# EAGLE design bottom (EAGLE 7.2.0)
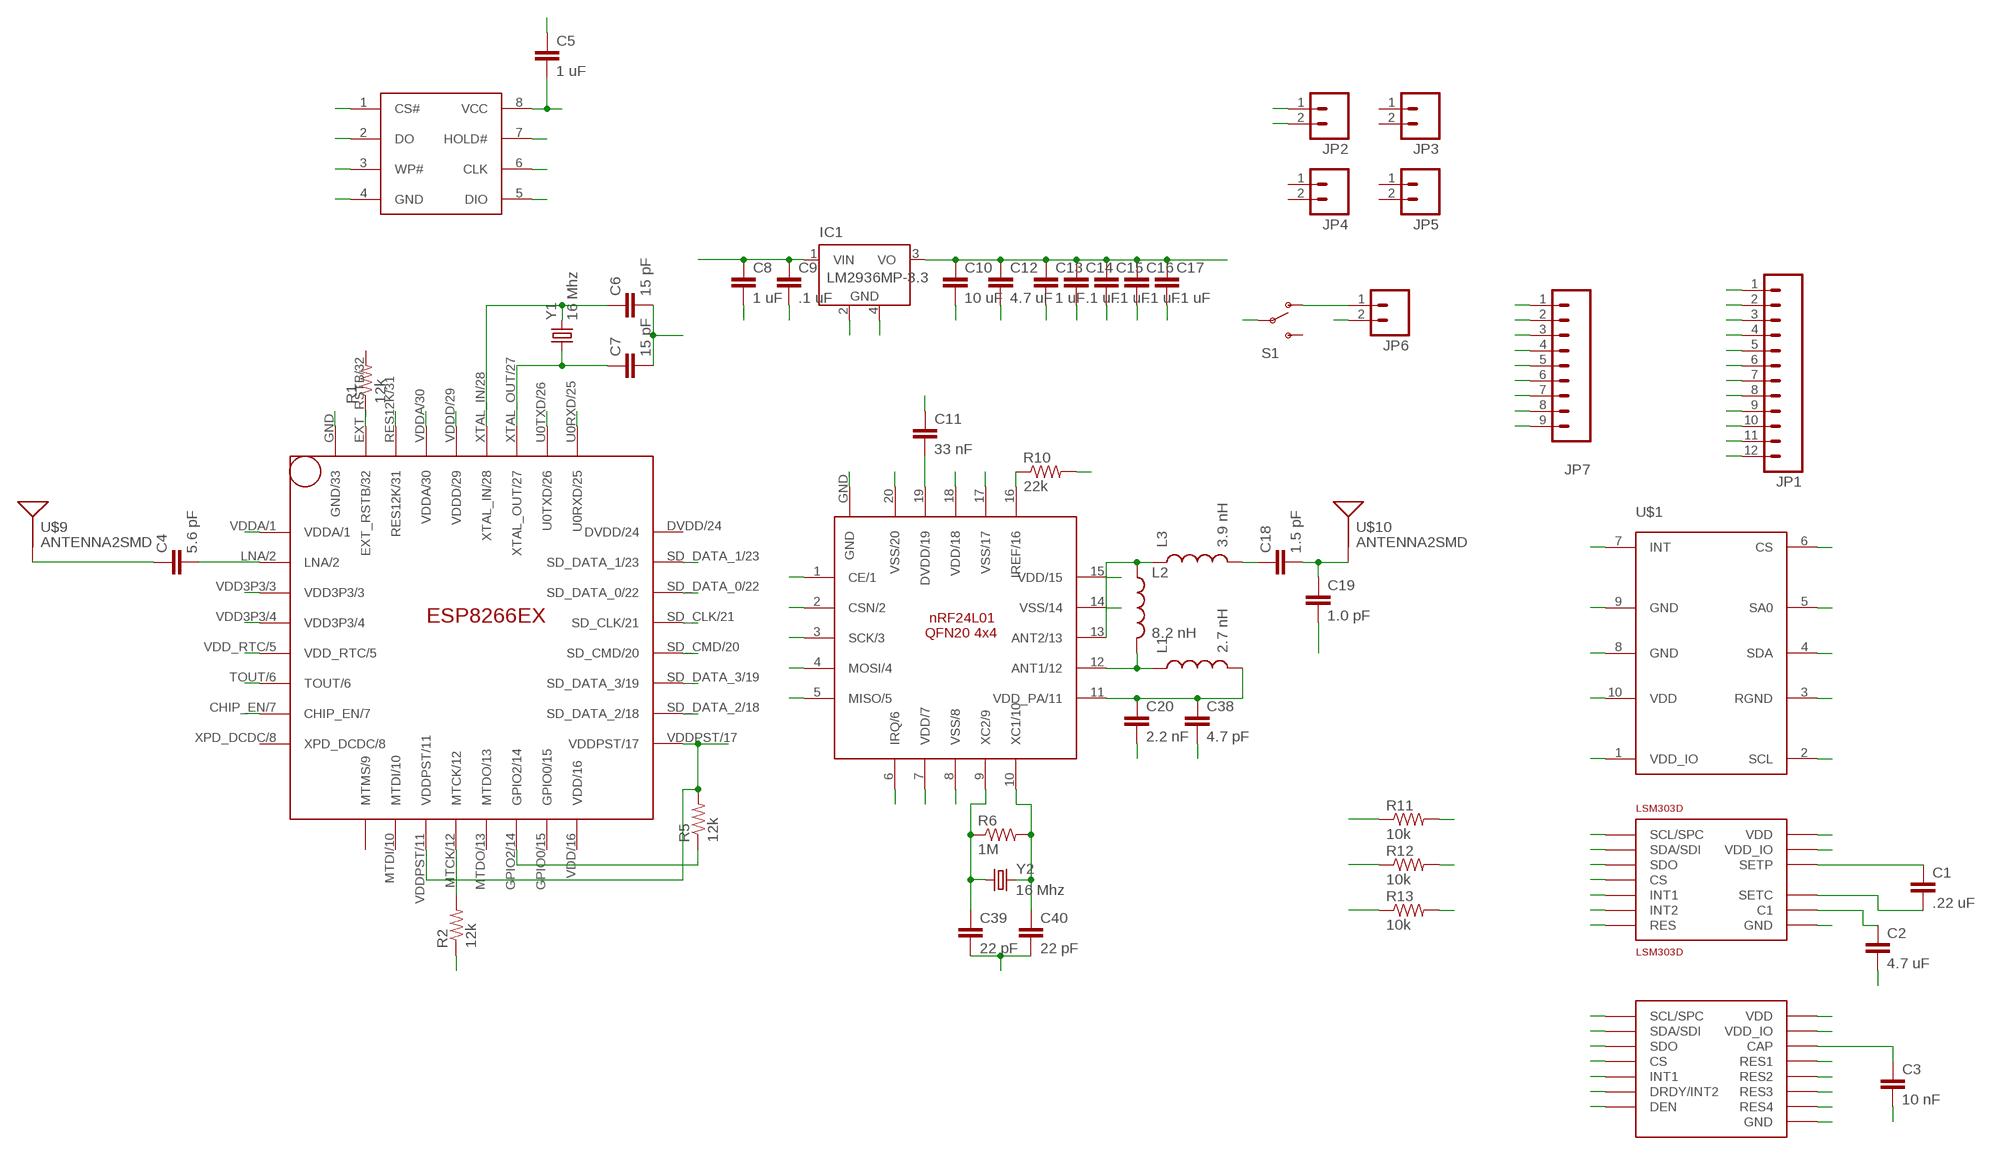
[diagram p0: schematic, sheet 1]

## Parts
C1  .22 uF  CAP0603-CAP  [0603-CAP]
C2  4.7 uF  CAP0603-CAP  [0603-CAP]
C3  10 nF  CAP0603-CAP  [0603-CAP]
C4  5.6 pF  CAP0603-CAP  [0603-CAP]
C5  1 uF  CAP0603-CAP  [0603-CAP]
C6  15 pF  CAP0603-CAP  [0603-CAP]
C7  15 pF  CAP0603-CAP  [0603-CAP]
C8  1 uF  CAP0603-CAP  [0603-CAP]
C9  .1 uF  CAP0603-CAP  [0603-CAP]
C10  10 uF  CAP0603-CAP  [0603-CAP]
C11  33 nF  CAP0603-CAP  [0603-CAP]
C12  4.7 uF  CAP0603-CAP  [0603-CAP]
C13  1 uF  CAP0603-CAP  [0603-CAP]
C14  .1 uF  CAP0603-CAP  [0603-CAP]
C15  .1 uF  CAP0603-CAP  [0603-CAP]
C16  .1 uF  CAP0603-CAP  [0603-CAP]
C17  .1 uF  CAP0603-CAP  [0603-CAP]
C18  1.5 pF  CAP0603-CAP  [0603-CAP]
C19  1.0 pF  CAP0603-CAP  [0603-CAP]
C20  2.2 nF  CAP0603-CAP  [0603-CAP]
C38  4.7 pF  CAP0603-CAP  [0603-CAP]
C39  22 pF  CAP0603-CAP  [0603-CAP]
C40  22 pF  CAP0603-CAP  [0603-CAP]
IC1  LM2936MP-3.3  [SOT223]
JP1  M12PTH  [1X12]
JP2  M02LOCK  [1X02_LOCK]
JP3  M02LOCK  [1X02_LOCK]
JP4  M02LOCK  [1X02_LOCK]
JP5  M02LOCK  [1X02_LOCK]
JP6  M02LOCK  [1X02_LOCK]
JP7  M09  [1X09]
L1  2.7 nH  INDUCTOR0402  [C0402]
L2  8.2 nH  INDUCTOR0402  [C0402]
L3  3.9 nH  INDUCTOR0402  [C0402]
LSM303D  LSM303D  [LGA16L]
MESH  NRF24L01  [QFN20(4X4)]
R1  12k  RESISTOR0603-RES  [0603-RES]
R2  12k  RESISTOR0603-RES  [0603-RES]
R5  12k  RESISTOR0603-RES  [0603-RES]
R6  1M  RESISTOR0603-RES  [0603-RES]
R10  22k  RESISTOR0603-RES  [0603-RES]
R11  10k  RESISTOR0603-RES  [0603-RES]
R12  10k  RESISTOR0603-RES  [0603-RES]
R13  10k  RESISTOR0603-RES  [0603-RES]
S1  SWITCH-SPDT-SMD-A  [SWITCH-SPST-SMD-A]
U$1  LPS25H  [LPS25H]
U$2  L3GD20H  [LGA16L]
U$3  25Q40  [SOP8]
U$9  ANTENNA2SMD  [ANTENNA-CHIP2]
U$10  ANTENNA2SMD  [ANTENNA-CHIP2]
WIFI  ESP8266EX  [QFN32]
Y1  16 Mhz  CRYSTAL5X3  [CRYSTAL-SMD-5X3]
Y2  16 Mhz  CRYSTAL5X3  [CRYSTAL-SMD-5X3]

## Nets
CE: JP7.3 MESH.1(CE/1)
CSN: JP7.4 MESH.2(CSN/2)
GND: C2.2 C5.1 C6.2 C7.2 C8.2 C9.2 C10.2 C11.1 C12.2 C13.2 C14.2 C15.2 C16.2 C17.2 C19.2 C20.2 C38.2 C39.2 C40.2 IC1.2(GND) IC1.4(GND) JP1.1 JP1.2 JP1.3 JP1.4 JP1.5 JP1.6 JP2.2 JP6.2 LSM303D.P$5(GND) LSM303D.P$10(RES) LSM303D.P$12(GND) LSM303D.P$13(GND) LSM303D.P$16(GND) MESH.8(VSS/8) MESH.14(VSS/14) MESH.17(VSS/17) MESH.20(VSS/20) R2.1 R10.2 U$1.3(RGND) U$1.8(GND) U$1.9(GND) U$2.P$8(DEN) U$2.P$9(RES1) U$2.P$10(RES2) U$2.P$11(RES3) U$2.P$12(GND) U$2.P$13(GND) U$3.4(GND) WIFI.GND(GND/33)
IQR: MESH.6(IRQ/6)
MISO: JP7.6 MESH.5(MISO/5)
MOSI: JP7.5 MESH.4(MOSI/4)
N$1: C4.1 U$9.FEED(SIGNAL)
N$2: R5.1 WIFI.GPIO2/14
N$3: R2.2 WIFI.MTCK/12
N$5: L1.1 L2.2 MESH.12(ANT1/12)
N$6: C18.1 L3.2
N$10: C18.2 C19.1 U$10.FEED(SIGNAL)
N$11: U$2.P$7(INT1)
N$12: U$2.P$6(DRDY/INT2)
N$13: C4.2 WIFI.LNA/2
N$14: U$1.7(INT)
N$16: C39.1 MESH.9(XC2/9) R6.1 Y2.1
N$17: C40.1 MESH.10(XC1/10) R6.2 Y2.3
N$18: C20.1 C38.1 L1.2 MESH.11(VDD_PA/11)
N$19: L2.1 L3.1 MESH.13(ANT2/13)
N$22: C3.1 U$2.P$14(CAP)
N$24: MESH.16(IREF/16) R10.1
N$28: C11.2 MESH.19(DVDD/19)
N$30: MESH.GND
N$31: C3.2
N$35: LSM303D.P$11(INT1)
N$36: LSM303D.P$9(INT2)
N$38: WIFI.RES12K/31
N$42: C1.2 LSM303D.P$2(SETC)
N$43: C2.1 LSM303D.P$15(C1)
RST: R1.1 WIFI.EXT_RSTB/32
RTC: WIFI.VDD_RTC/5
RX_W: JP7.1 WIFI.U0TXD/26
SCK: JP7.7 MESH.3(SCK/3)
SCL: JP7.9 LSM303D.P$4(SCL/SPC) R12.2 U$1.2(SCL) U$2.P$2(SCL/SPC)
SD-CLK: U$3.6(CLK) WIFI.SD_CLK/21
SD-CMD: U$3.1(CS#) WIFI.SD_CMD/20
SD-D0: U$3.2(DO) WIFI.SD_DATA_0/22
SD-D1: U$3.5(DIO) WIFI.SD_DATA_1/23
SD-D2: U$3.7(HOLD#) WIFI.SD_DATA_2/18
SD-D3: U$3.3(WP#) WIFI.SD_DATA_3/19
SDA: JP7.8 LSM303D.P$6(SDA/SDI) R11.2 U$1.4(SDA) U$2.P$3(SDA/SDI)
SDO: LSM303D.P$7(SDO) R13.2 U$1.5(SA0) U$2.P$4(SDO)
SETP: C1.1 LSM303D.P$3(SETP)
TOUT: WIFI.TOUT/6
TX_W: JP7.2 WIFI.U0RXD/25
VDD: C5.2 C10.1 C12.1 C13.1 C14.1 C15.1 C16.1 C17.1 IC1.3(VO) JP1.7 JP1.8 JP1.9 JP1.10 JP1.11 JP1.12 JP2.1 LSM303D.P$1(VDD_IO) LSM303D.P$8(CS) LSM303D.P$14(VDD) MESH.7(VDD/7) MESH.15(VDD/15) MESH.18(VDD/18) R5.2 R11.1 R12.1 R13.1 U$1.1(VDD_IO) U$1.6(CS) U$1.10(VDD) U$2.P$1(VDD_IO) U$2.P$5(CS) U$2.P$15(RES4) U$2.P$16(VDD) U$3.8(VCC) WIFI.CHIP_EN/7 WIFI.VDD3P3/3 WIFI.VDD3P3/4 WIFI.VDDA/1 WIFI.VDDA/30 WIFI.VDDD/29 WIFI.VDDPST/11 WIFI.VDDPST/17
VIN: JP6.1 S1.1(O)
VRAW: C8.1 C9.1 IC1.1(VIN) S1.2(P)
XTAL_IN: C6.1 WIFI.XTAL_IN/28 Y1.3
XTAL_OUT: C7.1 WIFI.XTAL_OUT/27 Y1.1
Unconnected: JP3.1 JP3.2 JP4.1 JP4.2 JP5.1 JP5.2 R1.2 S1.3(S) WIFI.DVDD/24 WIFI.GPIO0/15 WIFI.MTDI/10 WIFI.MTDO/13 WIFI.MTMS/9 WIFI.VDD/16 WIFI.XPD_DCDC/8

## Library data of the parts
C1-C20 C38-C40 = SparkFun-Capacitors:CAP: Capacitor Standard 0603 ceramic capacitor, and 0.1" leaded capacitor.
IC1 = national-semiconductor:LM2936MP?*: Ultra-Low Quiescent Current LDO Voltage Regulator Source: Data sheet <http://www.national.com/ds/LM/LM2936.pdf>; MF: NATIONAL SEMICONDUCTOR; MPN: LM2936MP-3.3/NOPB; OC_FARNELL: 1469062; OC_NEWARK: 41K4523
JP1 = SparkFun-Connectors:M12: Header 12 Standard 12-pin 0.1" header. Use with straight break away headers (SKU : PRT-00116), right angle break away headers (PRT-00553), swiss pins (PRT-00743), machine pins (PRT-00117), and female headers (PRT-00115).
JP2-JP6 = SparkFun-Connectors:M02: Standard 2-pin 0.1" header. Use with - straight break away headers ( PRT-00116) - right angle break away headers (PRT-00553) - swiss pins (PRT-00743) - machine pins (PRT-00117) - female headers (PRT-00115) Molex polarized connector foot print use with: PRT-08233 with associated crimp pins and housings. 2.54_SCREWTERM for use with PRT-10571. 3.5mm Screw Terminal footprints for PRT-08084 5mm Screw Terminal footprints for use with PRT-08432
JP7 = SparkFun-Connectors:M09: Header 9 Standard 9-pin 0.1" header. Use with straight break away headers (SKU : PRT-00116), right angle break away headers (PRT-00553), swiss pins (PRT-00743), machine pins (PRT-00117), and female headers (PRT-00115).
L1-L3 = SparkFun-Passives:INDUCTOR: Inductors Basic Inductor/Choke - 0603 and 1206. Footprints are not proven and vary greatly between part numbers. INDUCTOR POWER 3.3UH 4.0A SMD 0.197" L x 0.197" W x 0.177" H (5.00mm x 5.00mm x 4.50mm)
LSM303D = st:LSM303D
MESH = RF:NRF24L01
R1 R2 R5 R6 R10-R13 = SparkFun-Resistors:RESISTOR: Resistor Basic schematic elements and footprints for 0603, 1206, and PTH resistors.
S1 = SparkFun-Electromechanical:SWITCH-SPDT: SPDT Switch Simple slide switch, Spark Fun Electronics SKU : COM-00102 DPDT SMT slide switch, AYZ0202, SWCH-08179
U$1 = chips:LPS25H: ST-Micro Piezoresistive pressure sensor; DIGIKEY: 497-15070-1-ND
U$2 = st:L3GD20H
U$3 = wifi:25Q40
U$9 U$10 = SparkFun-RF:ANTENNA2: Chip antenna Single endded antenna. Common with smaller chip antennas. CHIP4 package is the GPS Chip Antenna SKU: GPS-08418. CHIP5 package is 2.4GHz chip antenna SKU: WRL-00144.
WIFI = wifi:ESP8266EX
Y1 Y2 = SparkFun-FreqCtrl:CRYSTAL: Various standard crystals. Proven footprints.; PROD_ID: XTAL-08218

## Board
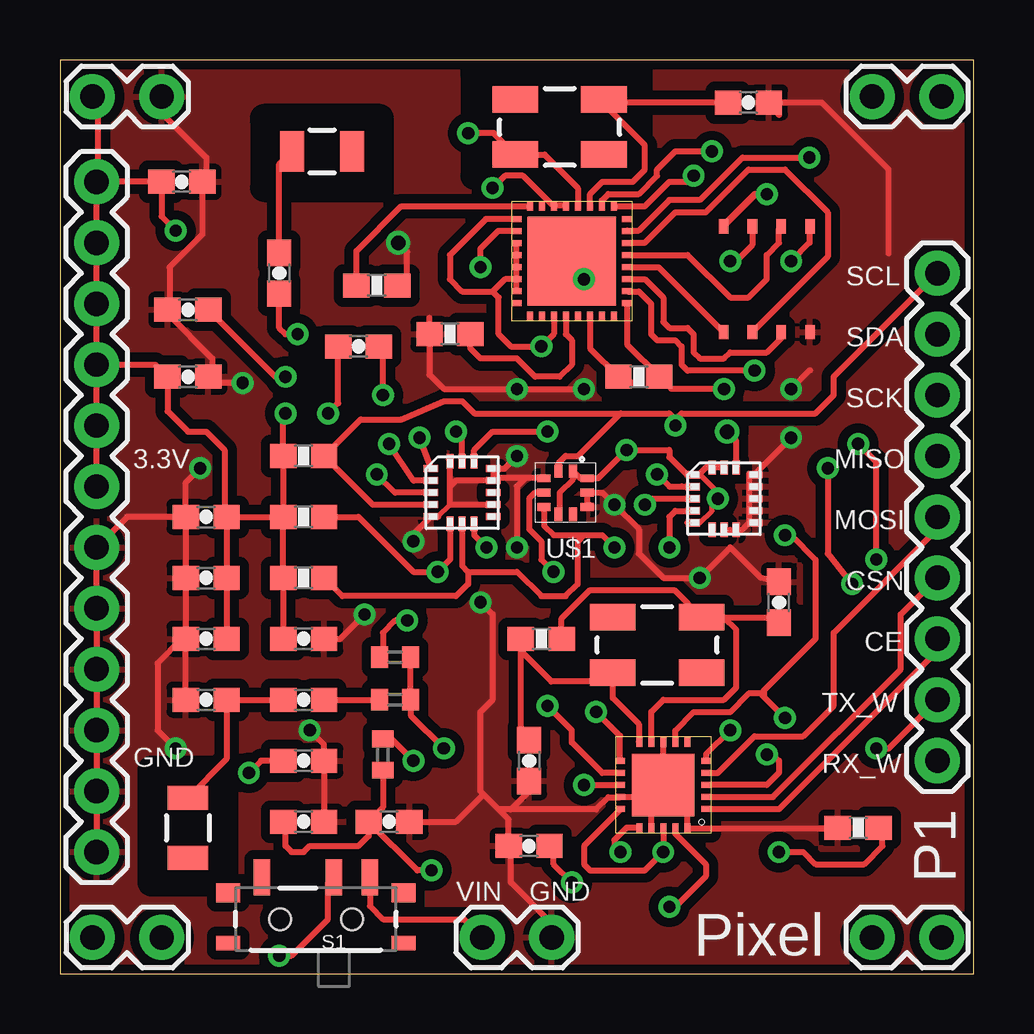
[diagram p1: board, top side]
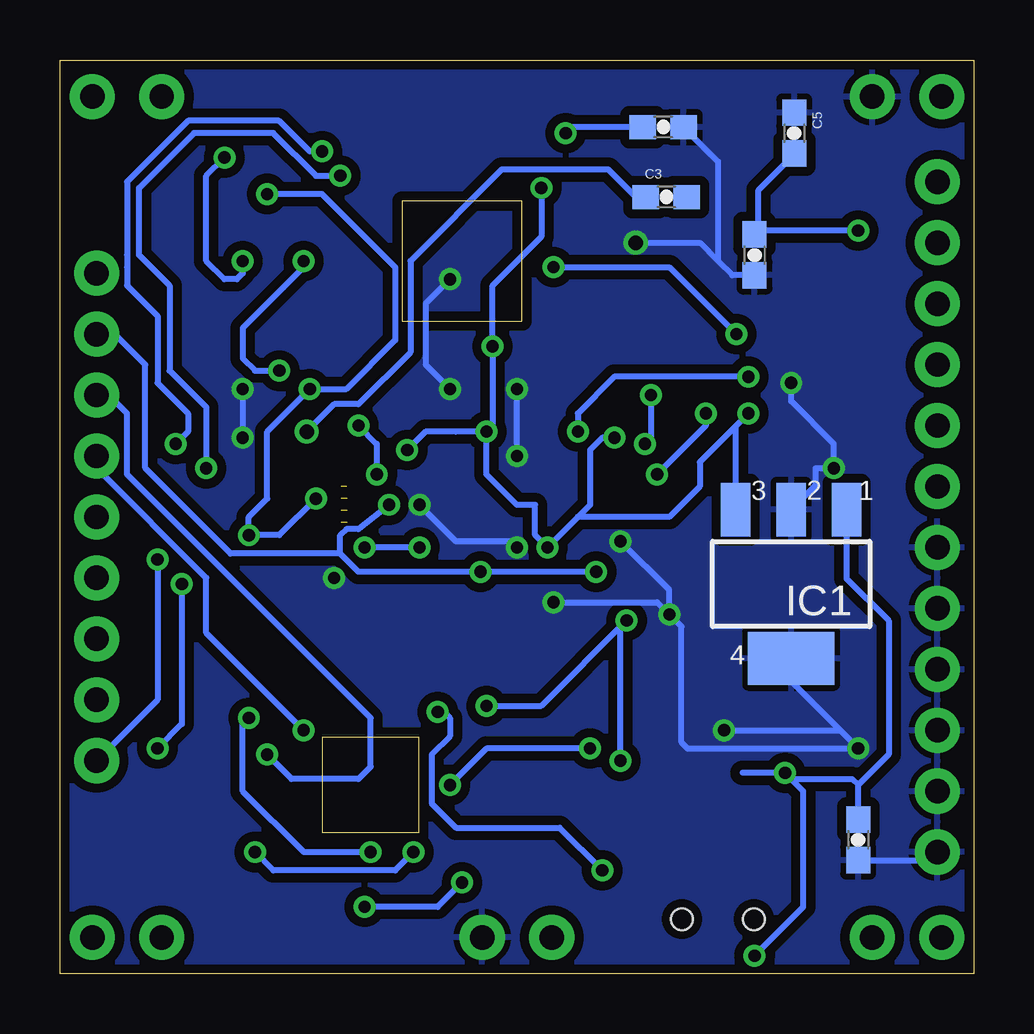
[diagram p2: board, bottom side, seen from below]

Size 38.1 x 38.1 mm. Coordinates in mm from the lower left corner, seen from the top.
Outline: 0,0 38.1,0 38.1,38.1 0,38.1 0,0
Copper layers (1*16): Top 0.035mm / dielectric 1.5mm / Bottom 0.035mm
Design rules "default *": minimum track width 10mil, minimum drill 20mil, track to track 5mil, track to pad 5mil, pad to pad 5mil, via to via 5mil, smd to smd 5mil, copper to edge 5mil, drill to drill 8mil, minimum pad ring 10mil, minimum via ring 8mil, stop-mask expansion 4mil, vias tented up to drill 0mil, thermal gap 10mil
tRestrict: area 17.3,33.3 to 24.1,37.5; area 3.8,3.8 to 6.9,8.5; area 8.5,32.8 to 13.3,35.7

### Footprints (pad centres in the part's own frame; a part is rotated, then mirrored left to right if it is on the bottom)
0603-CAP = smd 1.1 x 1: 1 -0.85,0; 2 0.85,0
SOT223 = smd 1.219 x 2.235: 1 -2.311,-3.099; 2 0,-3.099; 3 2.311,-3.099 | smd 3.6 x 2.2: 4 0,3.099
1X12 = drill 1.016 pad 1.88: 1 0,0; 2 2.54,0; 3 5.08,0; 4 7.62,0; 5 10.16,0; 6 12.7,0; 7 15.24,0; 8 17.78,0; 9 20.32,0; 10 22.86,0; 11 25.4,0; 12 27.94,0
1X02_LOCK = drill 1.016 pad 1.88: 1 -0.178,0; 2 2.718,0
1X09 = drill 1.016 pad 1.88: 1 0,0; 2 2.54,0; 3 5.08,0; 4 7.62,0; 5 10.16,0; 6 12.7,0; 7 15.24,0; 8 17.78,0; 9 20.32,0
C0402 = smd 0.7 x 0.9: 1 -0.65,0; 2 0.65,0
LGA16L = smd 0.6 x 0.3: P$1 -1.3,1; P$2 -1.3,0.5; P$3 -1.3,0; P$4 -1.3,-0.5; P$5 -1.3,-1; P$9 1.3,-1; P$10 1.3,-0.5; P$11 1.3,0; P$12 1.3,0.5; P$13 1.3,1 | smd 0.3 x 0.6: P$6 -0.5,-1.3; P$7 0,-1.3; P$8 0.5,-1.3; P$14 0.5,1.3; P$15 0,1.3; P$16 -0.5,1.3
QFN20(4X4) = smd 0.4 x 0.25: 1 -1.8,1; 2 -1.8,0.5; 3 -1.8,0; 4 -1.8,-0.5; 5 -1.8,-1; 11 1.8,-1; 12 1.8,-0.5; 13 1.8,0; 14 1.8,0.5; 15 1.8,1 | smd 0.25 x 0.4: 6 -1,-1.8; 7 -0.5,-1.8; 8 0,-1.8; 9 0.5,-1.8; 10 1,-1.8; 16 1,1.8; 17 0.5,1.8; 18 0,1.8; 19 -0.5,1.8; 20 -1,1.8 | smd 2.6 x 2.6: GND 0,0
0603-RES = smd 1.1 x 1: 1 -0.85,0; 2 0.85,0
SWITCH-SPST-SMD-A = smd 0.7 x 1.5: 1 -2.25,-1.75; 2 -0.75,-1.75; 3 2.25,-1.75 | smd 1 x 0.6: GND1 -3.65,1; GND3 3.65,1 | smd 1 x 0.8: GND2 -3.65,-1.1; GND4 3.65,-1.1 | hole 0.9: -1.5,0; 1.5,0
LPS25H = smd 0.32 x 0.55: 1 -0.3,-0.9; 2 0.3,-0.9; 6 0.3,0.9; 7 -0.3,0.9 | smd 0.55 x 0.32: 3 0.9,-0.6; 4 0.9,0; 5 0.9,0.6; 8 -0.9,0.6; 9 -0.9,0; 10 -0.9,-0.6
SOP8 = smd 0.6 x 0.4: 1 -2.2,1.8; 2 -2.2,0.6; 3 -2.2,-0.6; 4 -2.2,-1.8; 5 2.2,-1.8; 6 2.2,-0.6; 7 2.2,0.6; 8 2.2,1.8
ANTENNA-CHIP2 = smd 1.7 x 1: FEED 0,1.25; P$2 0,-1.25
QFN32 = smd 0.4 x 0.25: CHIP_EN/7 -2.3,-1.25; DVDD/24 2.3,1.75; LNA/2 -2.3,1.25; SD_CLK/21 2.3,0.25; SD_CMD/20 2.3,-0.25; SD_DATA_0/22 2.3,0.75; SD_DATA_1/23 2.3,1.25; SD_DATA_2/18 2.3,-1.25; SD_DATA_3/19 2.3,-0.75; TOUT/6 -2.3,-0.75; VDD3P3/3 -2.3,0.75; VDD3P3/4 -2.3,0.25; VDD_RTC/5 -2.3,-0.25; VDDA/1 -2.3,1.75; VDDPST/17 2.3,-1.75; XPD_DCDC/8 -2.3,-1.75 | smd 0.25 x 0.4: EXT_RSTB/32 -1.75,2.3; GPIO0/15 1.25,-2.3; GPIO2/14 0.75,-2.3; MTCK/12 -0.25,-2.3; MTDI/10 -1.25,-2.3; MTDO/13 0.25,-2.3; MTMS/9 -1.75,-2.3; RES12K/31 -1.25,2.3; U0RXD/25 1.75,2.3; U0TXD/26 1.25,2.3; VDD/16 1.75,-2.3; VDDA/30 -0.75,2.3; VDDD/29 -0.25,2.3; VDDPST/11 -0.75,-2.3; XTAL_IN/28 0.25,2.3; XTAL_OUT/27 0.75,2.3 | smd 3.7 x 3.7: GND 0,0
CRYSTAL-SMD-5X3 = smd 1.9 x 1.1: 1 -1.85,-1.15; 2 1.85,-1.15; 3 1.85,1.15; 4 -1.85,1.15

### Placement (x,y rotation side)
C1  12.45,26.16 0 top
C2  5.33,27.69 180 top
C3  12.83,32.38 0 bottom
C4  9.14,29.21 270 top
C5  7.49,35.05 270 bottom
C6  12.95,35.31 0 bottom
C7  28.7,36.32 0 top
C8  4.83,5.59 270 bottom
C9  10.16,8.89 0 top
C10  5.33,24.89 0 top
C11  19.56,5.33 0 top
C12  10.16,13.97 0 top
C13  6.1,19.05 180 top
C14  6.1,16.51 180 top
C15  6.1,13.97 180 top
C16  9.14,29.97 270 bottom
C17  5.08,33.02 0 top
C18  10.16,11.43 180 top
C19  6.1,11.43 180 top
C20  13.72,6.35 0 top
C38  10.16,6.35 0 top
C39  29.97,15.49 90 top
C40  19.56,8.89 270 top
IC1  7.62,16.26 180 bottom
JP1  1.52,5.08 90 top
JP2  1.52,36.58 0 top
JP3  34.04,36.58 0 top
JP4  34.04,1.52 0 top
JP5  1.52,1.52 0 top
JP6  17.78,1.52 0 top
JP7  36.58,8.89 90 top
L1  13.46,9.14 270 top
L2  13.97,13.21 180 top
L3  13.97,11.43 180 top
LSM303D  16.76,20.07 0 top
MESH  25.15,7.87 180 top
R1  13.21,28.7 0 top
R2  16.26,26.67 0 top
R5  24.13,24.89 0 top
R6  20.07,13.97 180 top
R10  33.27,6.1 180 top
R11  10.16,19.05 0 top
R12  10.16,21.59 0 top
R13  10.16,16.51 0 top
S1  10.67,2.29 180 top
U$1  21.08,20.07 180 top
U$2  27.69,19.81 0 top
U$3  29.46,28.96 90 top
U$9  10.92,34.29 90 top
U$10  5.33,6.1 0 top
WIFI  21.34,29.72 0 top
Y1  20.83,35.31 180 top
Y2  24.89,13.72 180 top

### Tracks (layer width: path | path; a pad name or v marks a point on that pad's centre or on a via)
CE
  Top 0.254: MESH.1 29.99,6.87 36.58,13.46 JP7.3
CSN
  Top 0.254: MESH.2 29.73,7.37 35.05,12.7 35.05,14.99 JP7.4
GND  (via drill 0.51, 0.6)
  Top 0.203: 16.26,19.56 15.76,19.07
  Top 0.254: C13.2 C14.2 C15.2 | C13.2 2.79,19.05 JP1.6 JP1.5 JP1.4 JP1.3 JP1.2 JP1.1 | 15.76,19.07 LSM303D.P$5 14.73,18.33 v14.73,18.03 | 16.26,20.32 16.26,19.56 18.03,19.56 18.04,19.57 LSM303D.P$10 | 16.26,20.32 16.26,21.36 LSM303D.P$16 | LSM303D.P$12 16.5,20.57 16.26,20.32 | LSM303D.P$12 LSM303D.P$13 18.53,21.07 v19.05,21.59 | U$1.3 19.4,20.67 | 19.4,20.67 18.16,20.67 LSM303D.P$12 | 22.07,19.56 U$1.8 U$1.9 22.61,20.07 v23.11,19.56 24.13,18.54 24.13,17.53 25.15,16.51 v26.67,16.51 27.94,17.78 | 27.94,18.5 27.93,18.51 U$2.P$8 28.43,18.51 28.73,18.81 28.73,20.86 28.99,20.86 v30.48,22.35 | 19.4,20.67 19.05,20.32 v19.05,17.78 | C12.2 11.68,13.97 v12.7,14.99 | C19.2 C15.2 | C39.2 29.21,16.51 27.94,17.78 | MESH.14 23.34,7.37 22.86,7.37 22.35,6.86 18.8,6.86 | 18.8,6.86 18.29,6.86 | 18.29,6.86 17.65,7.49 | 17.65,7.49 17.53,7.62 17.53,10.92 18.03,11.43 18.03,14.99 v17.53,15.49 | C40.2 19.56,7.62 18.8,6.86 | C15.2 5.08,13.97 4.06,12.95 4.06,10.16 v4.83,9.4 | MESH.14 23.87,7.37 24.64,6.6 24.64,6.08 MESH.17 | MESH.14 23.88,7.37 24.77,8.26 | 24.77,8.26 25.15,8.64 MESH.8 | 24.77,8.26 26.15,6.87 MESH.20 32.42,6.07 R10.2 | C38.2 C9.2 11.01,9.56 v10.41,10.16 | 18.29,6.86 18.71,6.44 C11.1 18.8,5.25 18.8,3.81 20.5,2.11 JP6.2 | C20.2 16.51,6.35 17.65,7.49 | C13.2 5.25,20.49 v5.84,21.08 | v7.62,24.64 6.44,24.64 C10.2 6.35,25.06 6.35,25.65 4.48,27.52 C2.2 4.57,27.77 4.57,29.46 5.93,30.82 C17.2 6.1,33.19 6.1,34.04 4.24,35.89 JP2.2 | WIFI.GND 21.34,29.46 v21.84,28.96 | v21.84,24.38 v19.05,24.38 16,24.38 15.41,24.98 R2.1 15.41,27.35 | 29.97,35.81 C7.2 31.75,36.32 34.54,33.53 34.54,30.04 | 31.26,25.17 v30.48,24.38
  Top 0.254: 27.93,17.79 27.94,17.78 | 14.48,29.12 14.48,30.1 v14.1,30.48
  Bottom 0.254: v19.05,17.78 19.3,18.03 21.59,18.03 v23.11,19.56 | v19.05,21.59 v19.05,24.38 | v12.7,14.99 12.7,16 v14.73,18.03 | v17.53,15.49 13.21,15.49 v12.7,14.99 | v12.7,14.99 12.19,14.48 12.19,9.65 11.94,9.4 v4.83,9.4 | IC1.4 7.62,12.19 v4.83,9.4 | IC1.2 6.6,20.37 6.6,21.08 v5.84,21.08 5.84,22.1 7.62,23.88 v7.62,24.64 | v21.84,28.96 22.86,27.94 22.86,25.4 v21.84,24.38 | C16.2 10.07,29.12 10.67,29.72 | v30.48,24.38 v30.48,22.35 | C8.2 1.87,4.74 JP1.1 | v10.41,10.16 5.59,10.16 v4.83,9.4 | C6.2 10.67,33.87 10.67,29.72 | 10.67,29.72 11.43,30.48 v14.1,30.48
  pour Bottom (isolate 0.381): -15.24,-12.7 56.13,-12.7 56.13,-14.99 58.17,-14.99 58.17,51.56 -15.24,47.75
  pour Top (isolate 0.381): -19.81,56.64 -22.86,56.64 -22.86,-23.62 77.47,-23.62 77.47,-18.29 66.8,-18.29 66.8,65.79 -21.59,65.79
MISO  (via drill 0.51)
  Top 0.254: MESH.5 26.95,9.17 v27.94,10.16
  Bottom 0.254: JP7.6 36.58,21.08 32,16.51 32,14.22 v27.94,10.16
MOSI
  Top 0.254: MESH.4 27.42,8.37 28.96,9.91 30.99,9.91 32.26,11.18 32.26,14.22 36.58,18.54 JP7.5
N$1
  Top 0.254: C4.1 9.14,33.76 U$9.FEED
N$2
  Top 0.254: WIFI.GPIO2/14 22.1,27.41 22.1,26.07 R5.1 23.88,24.64
N$3
  Top 0.254: R2.2 17.11,26.07 17.53,25.65 19.05,25.65 19.81,24.89 20.83,24.89 21.34,25.4 21.34,26.42 21.09,26.67 WIFI.MTCK/12
N$5  (via drill 0.51)
  Top 0.254: L1.1 13.83,9.79 v14.73,8.89 | v14.48,14.73 13.97,14.73 13.46,14.22 13.46,13.35 L2.2 | MESH.12 22.61,8.37 21.34,9.65 21.34,10.16 v20.32,11.18
  Bottom 0.254: v14.73,8.89 14.73,14.48 v14.48,14.73 18.03,11.18 v20.32,11.18
N$6
  Top 0.254: C18.1 L3.2
N$10
  Top 0.254: C18.2 C19.1 6.95,8.96 U$10.FEED
N$13  (via drill 0.51)
  Top 0.254: v9.91,26.67 9.4,26.67 9.14,26.92 C4.2 | WIFI.LNA/2 18.27,30.97 17.53,30.23 v17.53,29.46
  Bottom 0.254: v17.53,29.46 12.7,29.46 v9.91,26.67
N$16
  Top 0.254: Y2.1 29.75,14.87 C39.1 | MESH.9 24.65,10.93 25.15,11.43 27.69,11.43 28.19,11.94 28.19,14.36 27.69,14.87 Y2.1 | R6.1 20.92,14.82 22.1,16 25.61,16 Y2.1
N$17
  Top 0.254: Y2.3 23.04,12.37 | MESH.10 24.13,9.69 24.13,10.41 23.04,11.5 23.04,12.12 | 23.04,12.12 23.04,12.37 | 23.04,12.37 23.11,12.45 | C40.1 19.22,10.08 19.22,13.46 | 19.22,13.46 R6.2 | 23.04,12.12 23.11,12.19 20.49,12.19 19.22,13.46
N$18  (via drill 0.51)
  Top 0.254: C20.1 12.87,5.75 12.45,5.33 10.41,5.33 10.16,5.08 9.65,5.08 9.4,5.33 9.4,6.26 C38.1 | MESH.11 23.35,9.93 v22.35,10.92 | v15.49,4.32 14.9,4.32 C20.1 | L1.2 13.46,6.95 C20.1
  Bottom 0.254: v22.35,10.92 22.1,10.92 21.84,10.67 21.84,9.91 22.61,9.14 22.61,7.11 21.59,6.1 17.27,6.1 v15.49,4.32
N$19  (via drill 0.51)
  Top 0.254: L2.1 L3.1 14.62,10.78 v16,9.4 | v21.84,7.87 MESH.13
  Bottom 0.254: v16,9.4 20.32,9.4 v21.84,7.87
N$22  (via drill 0.6)
  Top 0.254: v27.81,22.61 28.19,22.23 U$2.P$14
  Bottom 0.254: C3.1 14.1,32.38 15.24,33.53 19.68,33.53 23.5,29.72 23.5,25.91 25.65,23.75 26.67,23.75 v27.81,22.61
N$24  (via drill 0.51)
  Top 0.254: MESH.16 24.13,6.1 23.62,6.1 23.11,5.59 23.11,5.33 v23.37,5.08 | v29.97,5.08 30.99,5.08 31.5,4.57 33.53,4.57 34.29,5.33 34.29,5.93 R10.1
  Bottom 0.254: v23.37,5.08 24.13,4.32 29.21,4.32 v29.97,5.08
N$28  (via drill 0.51)
  Top 0.254: MESH.19 25.65,5.85 26.92,4.57 26.92,4.06 25.65,2.79 v25.4,2.79 | v21.34,3.81 20.57,4.57 20.57,5.17 C11.2
  Bottom 0.254: v21.34,3.81 22.35,2.79 v25.4,2.79
N$42  (via drill 0.51)
  Top 0.254: LSM303D.P$2 14.74,20.57 v13.72,22.1 | v13.46,24.13 13.46,26 C1.2
  Bottom 0.254: v13.46,24.13 13.46,22.35 v13.72,22.1
N$43  (via drill 0.51)
  Top 0.254: LSM303D.P$15 16.76,22.35 v16.51,22.61 | v9.4,24.89 8.98,24.89 C2.1
  Bottom 0.254: v9.4,24.89 14.99,24.89 16.51,23.37 v16.51,22.61
RST
  Top 0.254: R1.1 12.36,30.14 14.22,32 19.57,32 WIFI.EXT_RSTB/32
RX_W  (via drill 0.51)
  Top 0.254: WIFI.U0TXD/26 22.59,32.24 22.86,32.51 24.13,32.51 24.89,33.27 24.89,33.53 25.65,34.29 v27.18,34.29 | v34.04,17.27 34.04,21.34 v33.27,22.1
  Bottom 0.254: v33.27,22.1 32.77,22.61 32.77,23.37 34.04,24.64 34.04,27.43 35.31,28.7 35.31,29.46 35.31,29.97 35.31,33.02 32.77,35.56 28.96,35.56 27.69,34.29 v27.18,34.29 | v34.04,17.27 34.04,11.43 JP7.1
SCK  (via drill 0.51)
  Top 0.254: v29.46,9.14 29.72,9.14 29.97,8.89 29.97,8.38 29.46,7.87 MESH.3
  Bottom 0.254: v29.46,9.14 28.45,8.13 25.65,8.13 25.15,8.64 25.15,10.67 35.31,20.83 35.31,23.37 36.07,24.13 JP7.7
SCL  (via drill 0.51)  (1 unrouted)
  Top 0.254: 15.46,19.56 LSM303D.P$4 13.03,19.57 R12.2 12.53,23.11 14.22,23.11 16,23.88 16.76,23.88 17.27,23.37 23.37,23.37 | 25.4,20.32 25.91,20.32 | 25.91,20.32 26.12,20.32 | 26.12,20.32 26.13,20.31 | 25.4,20.32 25.41,20.31 25.9,20.31 25.91,20.32 | U$1.2 20.78,21.29 21.08,21.59 21.59,21.59 23.37,23.37 | 25.65,23.11 v25.65,22.86 | v24.89,20.83 25.4,20.32 | 23.37,23.37 25.4,23.37 25.65,23.11 | 25.65,23.11 25.91,23.37 31.5,23.37 32.26,24.13 32.26,24.89 JP7.9 | 26.12,20.32 26.16,20.32
  Bottom 0.254: v25.65,22.86 24.89,22.1 v24.89,20.83
SD-CLK
  Top 0.254: WIFI.SD_CLK/21 26.17,29.97 27.94,28.19 28.7,28.19 29.46,28.96 29.46,29.97 29.97,30.48 29.97,31.06 U$3.6
SD-CMD
  Top 0.254: WIFI.SD_CMD/20 24.96,29.46 U$3.1
SD-D0
  Top 0.254: WIFI.SD_DATA_0/22 23.86,30.47 23.88,30.48 24.38,30.48 25.65,31.75 26.92,31.75 28.7,33.53 30.23,33.53 32,31.75 32,29.9 U$3.2
SD-D1  (via drill 0.51)
  Top 0.254: WIFI.SD_DATA_1/23 23.66,30.99 24.13,30.99 25.4,32.26 26.67,32.26 28.45,34.04 v31.24,34.04 | 31.24,31.18 31.24,31.13 | v30.48,29.72 31.24,30.48 31.24,31.11 31.24,31.13 | U$3.5 31.24,31.13
  Bottom 0.254: v30.48,29.72 30.48,29.21 30.73,28.96 31.24,28.96 32,29.72 32,33.27 v31.24,34.04
SD-D2  (via drill 0.51)
  Top 0.254: v28.96,25.15 26.16,25.15 25.91,25.4 25.91,26.16 25.65,26.42 24.89,26.42 24.64,26.67 24.64,27.94 24.13,28.45 23.66,28.45 WIFI.SD_DATA_2/18 | v27.94,29.72 28.19,29.72 28.86,30.39 U$3.7
  Bottom 0.254: v28.96,25.15 29.97,25.15 30.48,25.65 30.48,26.92 27.94,29.46 v27.94,29.72
SD-D3
  Top 0.254: WIFI.SD_DATA_3/19 23.65,28.96 24.38,28.96 25.15,28.19 25.15,27.18 25.4,26.92 26.16,26.92 26.42,26.67 26.42,25.91 26.67,25.65 27.69,25.65 27.94,25.91 29.46,25.91 30.06,26.51 U$3.3
SDA  (via drill 0.51)  (1 unrouted)
  Top 0.254: 16.26,18.76 LSM303D.P$6 16.26,17.28 v15.75,16.76 14.73,16.76 12.45,19.05 R11.2 | U$1.4 19.81,20.07 19.56,19.81 19.56,18.54 20.07,18.03 20.07,17.27 v20.57,16.76 | v24.38,19.56 24.64,19.81 26.13,19.81
  Bottom 0.254: v15.75,16.76 v20.57,16.76 25.65,16.76 26.42,17.53 | v24.38,19.56 25.65,18.54 26.16,18.54 26.42,18.29 26.42,17.53 | 26.42,17.53 30.99,17.53 34.54,21.08 34.54,25.4 35.81,26.67 JP7.8
SDO  (via drill 0.51)  (1 unrouted)
  Top 0.254: U$1.5 20.18,18.68 20.57,18.29 21.84,18.29 | LSM303D.P$7 16.76,17.02 17.02,16.76 | 17.02,16.76 19.05,16.76 20.07,15.75 21.08,15.75 21.59,16.26 21.59,18.03 21.84,18.29 | v25.4,17.78 25.4,19.05 25.65,19.3 26.12,19.3 26.13,19.31 | 21.84,18.29 22.61,18.29 v23.11,17.78 | R13.2 11.77,15.75 16.51,15.75 17.02,16.26 17.02,16.76
  Bottom 0.254: v23.11,17.78 v25.4,17.78
SETP  (via drill 0.51)
  Top 0.254: LSM303D.P$3 13.97,20.07 v13.21,20.83 | v11.18,23.37 11.6,23.79 C1.1
  Bottom 0.254: v11.18,23.37 11.18,22.86 v13.21,20.83
TX_W  (via drill 0.51)
  Top 0.254: WIFI.U0RXD/25 23.1,32 24.38,32 25.4,33.02 26.16,33.02 v26.42,33.27 | v32,21.08 32,17.53 v33.02,16.26 | JP7.2 34.54,9.4 v34.04,9.4
  Bottom 0.254: v32,21.08 32,23.62 33.53,25.15 33.53,28.7 34.8,29.97 34.8,32.77 32.51,35.05 29.21,35.05 27.43,33.27 v26.42,33.27 | v33.02,16.26 33.02,10.41 v34.04,9.4
VDD  (via drill 0.51)  (1 unrouted)
  Top 0.127: 26.63,20.81 26.69,20.81
  Top 0.203: U$2.P$1 26.43,20.81 | 26.13,18.81 26.69,18.81 27.18,19.3 27.18,19.56 v27.43,19.81 27.43,20.07 26.69,20.81
  Top 0.254: C12.1 R13.1 R11.1 | C13.1 C14.1 C15.1 | LSM303D.P$14 17.26,21.84 18.03,22.61 v20.32,22.61 | LSM303D.P$8 17.26,18.3 v17.78,17.78 | LSM303D.P$1 15.46,21.11 v14.99,22.35 | U$1.6 20.83,19.21 20.83,20.07 21.38,20.62 U$1.1 21.68,20.67 U$1.10 | U$1.10 22.19,20.67 | 26.13,20.81 26.13,20.86 | U$1.10 22.44,20.67 v23.62,21.84 25.4,21.84 25.4,21.54 26.13,20.81 | R11.1 R12.1 9.31,23.28 v9.4,23.37 | MESH.15 23.35,6.84 21.84,5.33 21.84,4.57 22.1,4.32 24.38,4.32 v25.15,5.08 MESH.18 | v30.23,18.29 30.48,18.29 31.5,17.27 31.5,13.97 29.34,11.81 29.34,11.56 | 25.65,9.68 MESH.7 25.65,10.15 26.42,10.92 27.94,10.92 28.7,11.68 29.21,11.68 29.34,11.56 | 29.97,10.92 v30.23,10.67 29.34,11.56 | JP1.7 JP1.8 JP1.9 | JP1.9 JP1.10 JP1.11 JP1.12 | C13.1 R11.1 | JP1.9 3.98,25.4 C10.1 4.48,23.46 5.33,22.61 6.1,22.61 6.86,21.84 6.86,19.14 C13.1 | WIFI.CHIP_EN/7 19.04,28.95 19.03,28.96 | 19.03,28.96 WIFI.VDD3P3/4 WIFI.VDD3P3/3 | 18.03,28.45 16.76,28.45 16.26,28.96 16.26,29.97 17.75,31.47 WIFI.VDDA/1 | WIFI.VDDPST/11 20.59,26.68 v20.07,26.16 18.8,26.16 18.29,26.67 18.29,28.19 18.03,28.45 | JP1.12 C17.1 4.23,31.58 v4.83,30.99 | WIFI.VDDA/30 WIFI.VDDD/29 WIFI.VDDA/30 20.57,32 19.3,33.27 18.54,33.27 v18.03,32.77 | 19.03,28.96 18.54,28.96 18.03,28.45 | 27.66,31.22 28.96,32.51 v29.46,32.51 29.02,32.51 U$3.8 | WIFI.VDDPST/17 23.64,26.24 R5.2 25.49,24.38 v27.69,24.38 | JP1.12 1.6,33.1 1.6,36.32 JP2.1 | 26.13,20.81 U$2.P$1 26.63,20.81 26.93,21.11 U$2.P$16 U$2.P$15
  Bottom 0.254: v17.78,17.78 16,19.56 16,21.84 15.49,22.35 v14.99,22.35 | v17.78,17.78 16.51,19.05 12.7,19.05 11.43,20.32 11.43,21.34 v9.4,23.37 9.93,22.84 IC1.3 | v17.78,17.78 18.29,18.29 18.29,19.56 19.05,19.56 20.32,20.83 v20.32,22.61 | v20.32,22.61 21.59,22.61 | v20.32,22.61 22.86,22.61 v23.62,21.84 | v25.15,5.08 27.94,5.08 30.48,7.62 30.48,10.41 v30.23,10.67 | v20.32,22.61 20.07,22.86 v20.07,26.16 20.07,28.7 18.03,30.73 v18.03,32.77 | v4.83,30.99 8.98,30.99 | 8.98,30.99 C16.1 | 8.98,30.99 8.98,32.68 7.49,34.16 C5.2 | v29.46,32.51 27.18,32.51 24.13,29.46 24.13,26.42 26.16,24.38 v27.69,24.38 29.46,22.61 29.46,19.81 30.23,19.05 v30.23,18.29 28.96,18.29 v27.43,19.81
VIN
  Top 0.254: S1.1 12.92,2.83 13.46,2.29 16.84,2.29 JP6.1
VRAW  (via drill 0.51)
  Top 0.254: v9.14,0.76 9.65,0.76 11.18,2.29 11.18,3.79 S1.2 | C9.1 8.38,8.89 v7.87,8.38
  Bottom 0.254: IC1.1 5.31,16.48 3.56,14.73 3.56,9.14 4.83,7.87 | v7.87,8.38 7.62,8.13 5.08,8.13 4.83,7.87 | v7.87,8.38 9.65,8.38 | C8.1 4.83,7.87 | v9.14,0.76 7.11,2.79 7.11,7.62 v7.87,8.38
XTAL_IN  (via drill 0.51)
  Top 0.254: v17.02,35.05 18.08,35.05 Y1.3 20.2,34.16 21.59,32.77 WIFI.XTAL_IN/28
  Bottom 0.254: C6.1 16.76,35.31 v17.02,35.05
XTAL_OUT
  Top 0.254: WIFI.XTAL_OUT/27 22.1,32.51 22.61,33.02 23.88,33.02 24.38,33.53 24.38,34.54 22.68,36.25 Y1.1 22.81,36.32 C7.1

### Text on the board
tNames: SCL | SDA | SCK | 3.3V | MISO | MOSI | CSN | CE | TX_W | GND | RX_W | P1 | VIN | GND | Pixel